# EAGLE design leddriver_1 (EAGLE 8.2.0)
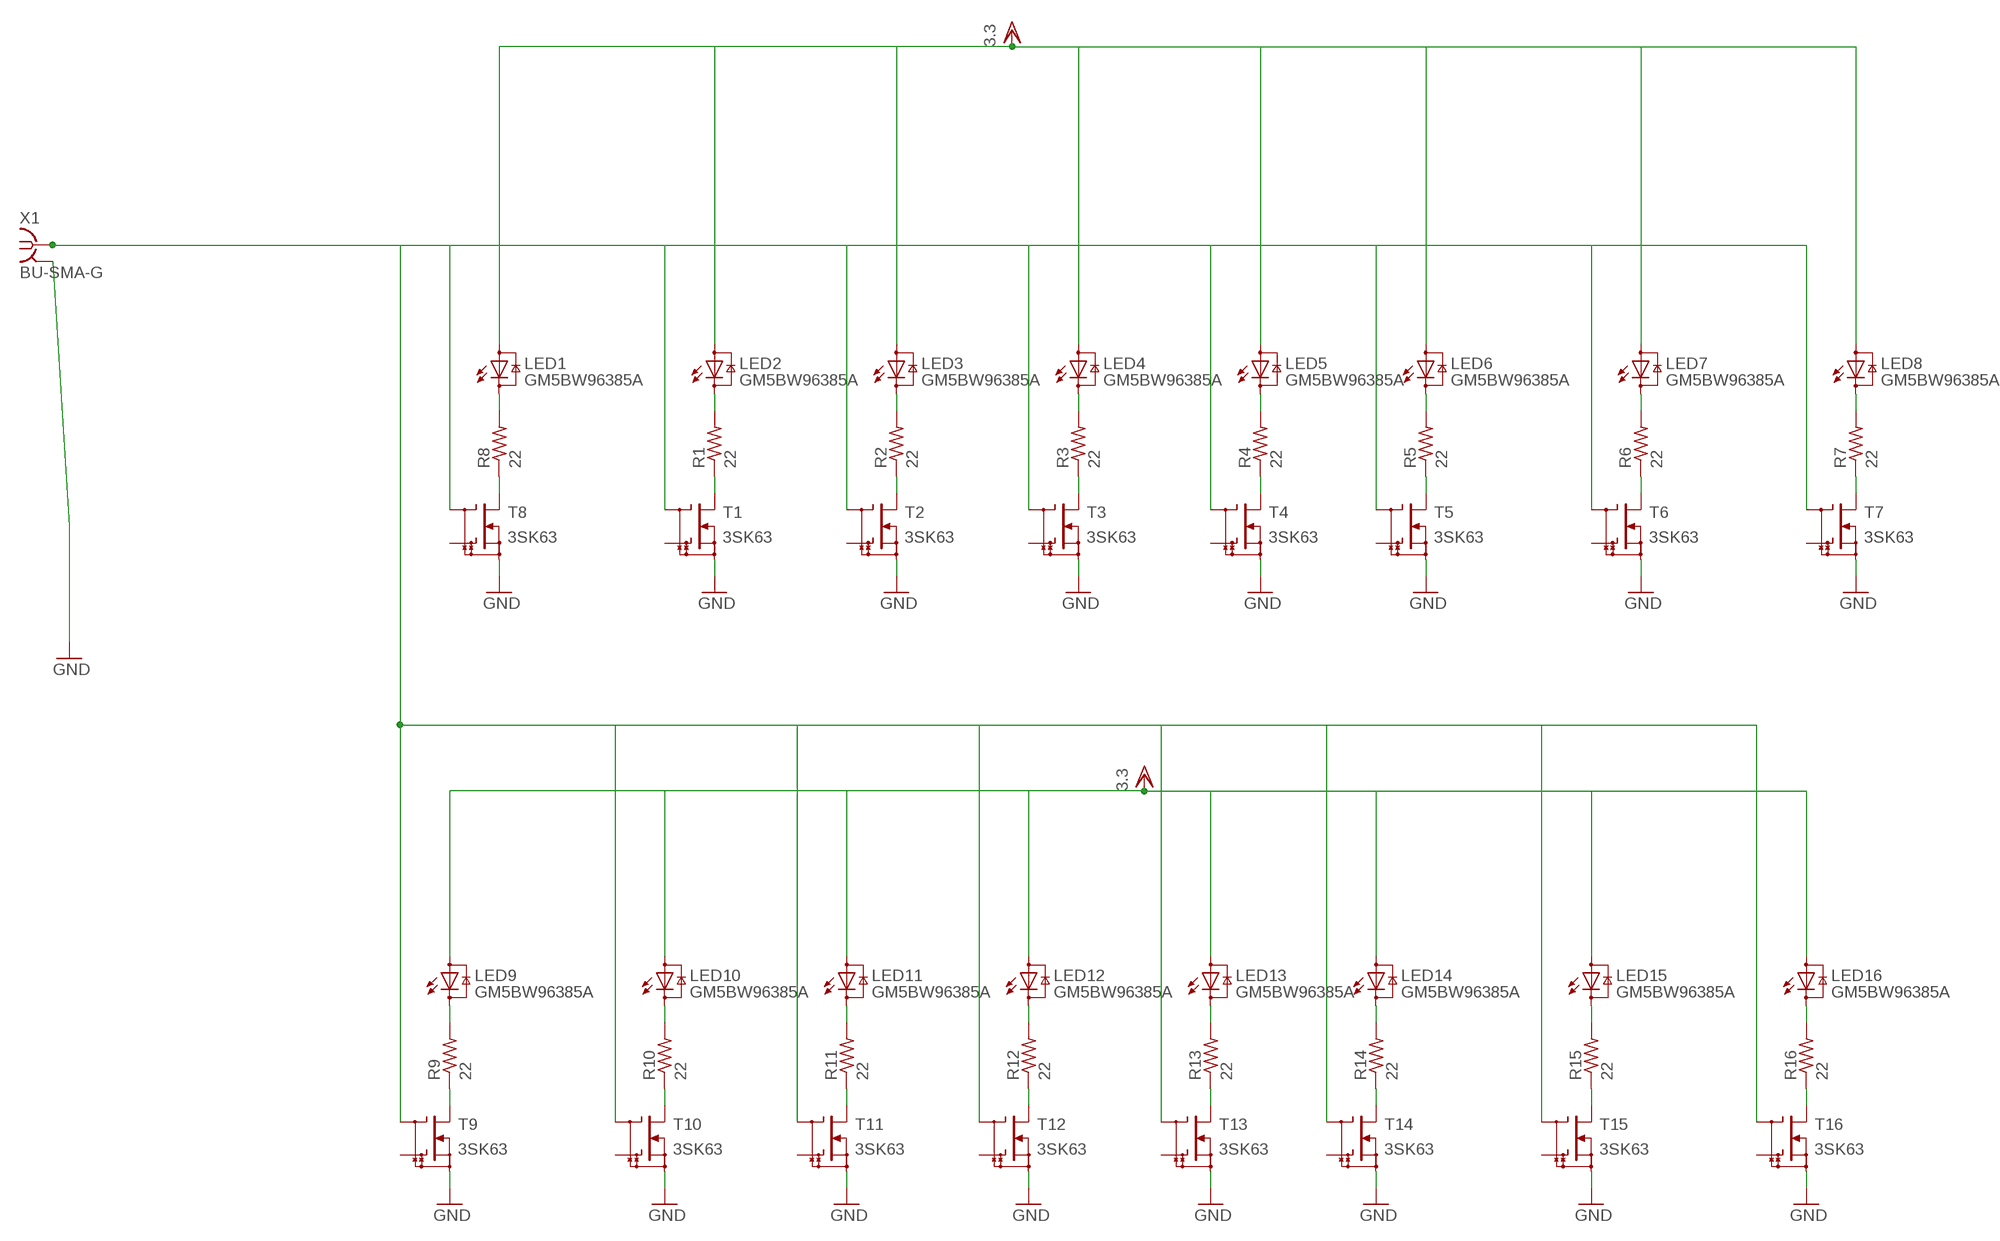
[diagram p0: schematic, sheet 1]

## Parts
LED1  GM5BW96385A  [GM5BW96385A]
LED2  GM5BW96385A  [GM5BW96385A]
LED3  GM5BW96385A  [GM5BW96385A]
LED4  GM5BW96385A  [GM5BW96385A]
LED5  GM5BW96385A  [GM5BW96385A]
LED6  GM5BW96385A  [GM5BW96385A]
LED7  GM5BW96385A  [GM5BW96385A]
LED8  GM5BW96385A  [GM5BW96385A]
LED9  GM5BW96385A  [GM5BW96385A]
LED10  GM5BW96385A  [GM5BW96385A]
LED11  GM5BW96385A  [GM5BW96385A]
LED12  GM5BW96385A  [GM5BW96385A]
LED13  GM5BW96385A  [GM5BW96385A]
LED14  GM5BW96385A  [GM5BW96385A]
LED15  GM5BW96385A  [GM5BW96385A]
LED16  GM5BW96385A  [GM5BW96385A]
R1  22  R-US_0207/5V  [0207/5V]
R2  22  R-US_0207/5V  [0207/5V]
R3  22  R-US_0207/5V  [0207/5V]
R4  22  R-US_0207/5V  [0207/5V]
R5  22  R-US_0207/5V  [0207/5V]
R6  22  R-US_0207/5V  [0207/5V]
R7  22  R-US_0207/5V  [0207/5V]
R8  22  R-US_0207/5V  [0207/5V]
R9  22  R-US_0207/5V  [0207/5V]
R10  22  R-US_0207/5V  [0207/5V]
R11  22  R-US_0207/5V  [0207/5V]
R12  22  R-US_0207/5V  [0207/5V]
R13  22  R-US_0207/5V  [0207/5V]
R14  22  R-US_0207/5V  [0207/5V]
R15  22  R-US_0207/5V  [0207/5V]
R16  22  R-US_0207/5V  [0207/5V]
T1  3SK63  [TO72]
T2  3SK63  [TO72]
T3  3SK63  [TO72]
T4  3SK63  [TO72]
T5  3SK63  [TO72]
T6  3SK63  [TO72]
T7  3SK63  [TO72]
T8  3SK63  [TO72]
T9  3SK63  [TO72]
T10  3SK63  [TO72]
T11  3SK63  [TO72]
T12  3SK63  [TO72]
T13  3SK63  [TO72]
T14  3SK63  [TO72]
T15  3SK63  [TO72]
T16  3SK63  [TO72]
X1  BU-SMA-G  [BU-SMA-G]

## Nets
GND: T1.4(SOURCE) T2.4(SOURCE) T3.4(SOURCE) T4.4(SOURCE) T5.4(SOURCE) T6.4(SOURCE) T7.4(SOURCE) T8.4(SOURCE) T9.4(SOURCE) T10.4(SOURCE) T11.4(SOURCE) T12.4(SOURCE) T13.4(SOURCE) T14.4(SOURCE) T15.4(SOURCE) T16.4(SOURCE) X1.2 X1.3 X1.4 X1.5
N$1: R8.1 T8.1(DRAIN)
N$2: LED2.C R1.2
N$3: LED1.C R8.2
N$4: R1.1 T1.1(DRAIN)
N$5: LED3.C R2.2
N$6: R2.1 T2.1(DRAIN)
N$7: LED4.C R3.2
N$8: R3.1 T3.1(DRAIN)
N$9: LED5.C R4.2
N$10: R4.1 T4.1(DRAIN)
N$11: LED6.C R5.2
N$12: R5.1 T5.1(DRAIN)
N$13: LED7.C R6.2
N$14: R6.1 T6.1(DRAIN)
N$15: LED8.C R7.2
N$16: R7.1 T7.1(DRAIN)
N$17: LED9.C R9.2
N$18: R9.1 T9.1(DRAIN)
N$19: LED10.C R10.2
N$20: R10.1 T10.1(DRAIN)
N$21: LED11.C R11.2
N$22: R11.1 T11.1(DRAIN)
N$23: LED12.C R12.2
N$24: R12.1 T12.1(DRAIN)
N$25: LED13.C R13.2
N$26: R13.1 T13.1(DRAIN)
N$27: LED14.C R14.2
N$28: R14.1 T14.1(DRAIN)
N$29: LED15.C R15.2
N$30: R15.1 T15.1(DRAIN)
N$31: LED16.C R16.2
N$32: R16.1 T16.1(DRAIN)
N$33: T1.3(G1) T2.3(G1) T3.3(G1) T4.3(G1) T5.3(G1) T6.3(G1) T7.3(G1) T8.3(G1) T9.3(G1) T10.3(G1) T11.3(G1) T12.3(G1) T13.3(G1) T14.3(G1) T15.3(G1) T16.3(G1) X1.1
VDD: LED1.A LED2.A LED3.A LED4.A LED5.A LED6.A LED7.A LED8.A LED9.A LED10.A LED11.A LED12.A LED13.A LED14.A LED15.A LED16.A ; supply symbol labelled 3.3
Unconnected: T1.2(G2) T2.2(G2) T3.2(G2) T4.2(G2) T5.2(G2) T6.2(G2) T7.2(G2) T8.2(G2) T9.2(G2) T10.2(G2) T11.2(G2) T12.2(G2) T13.2(G2) T14.2(G2) T15.2(G2) T16.2(G2)

## Library data of the parts
LED1-LED16 = led:GM5BW96385A: High brightness White Color LED 2300 mcd @ IF = 20mA achieved via InGaN Blue LED chip in combination with Yellow Phosphor Source: http://document.sharpsma.com/files/GM5BW96385A.pdf
R1-R16 = resistor:R-US_: RESISTOR, American symbol
T1-T16 = transistor:3SK63: N CHANNEL Dual Gate MOS FET VHF Amplifier Source: 3SK59.pdf
X1 = con-coax:BU-SMA-G: FEMALE SMA CONNECTOR Radiall distributor RS 193-9117; OC_FARNELL: unknown; OC_NEWARK: unknown

## Board
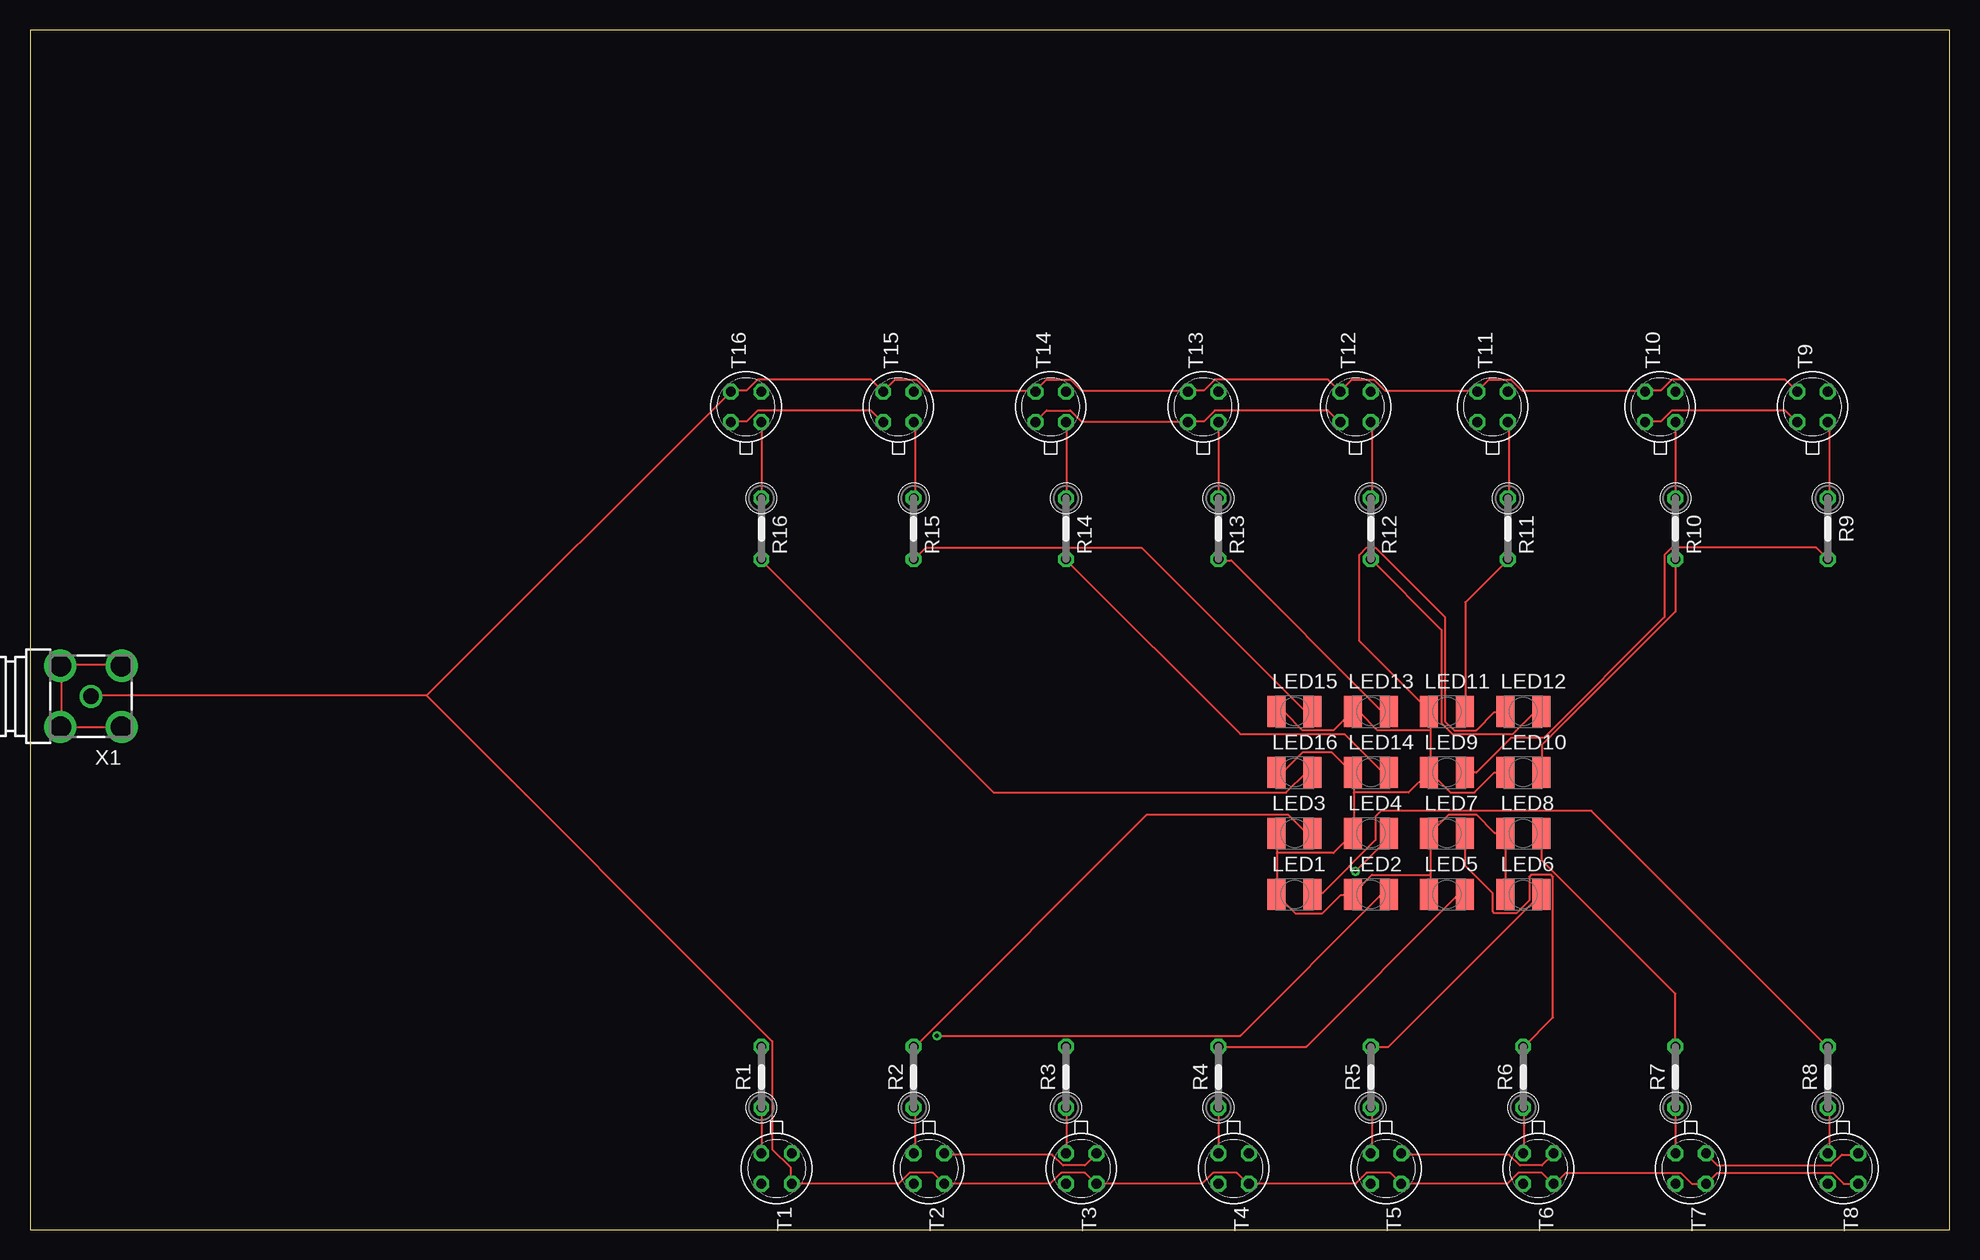
[diagram p1: board, top side]
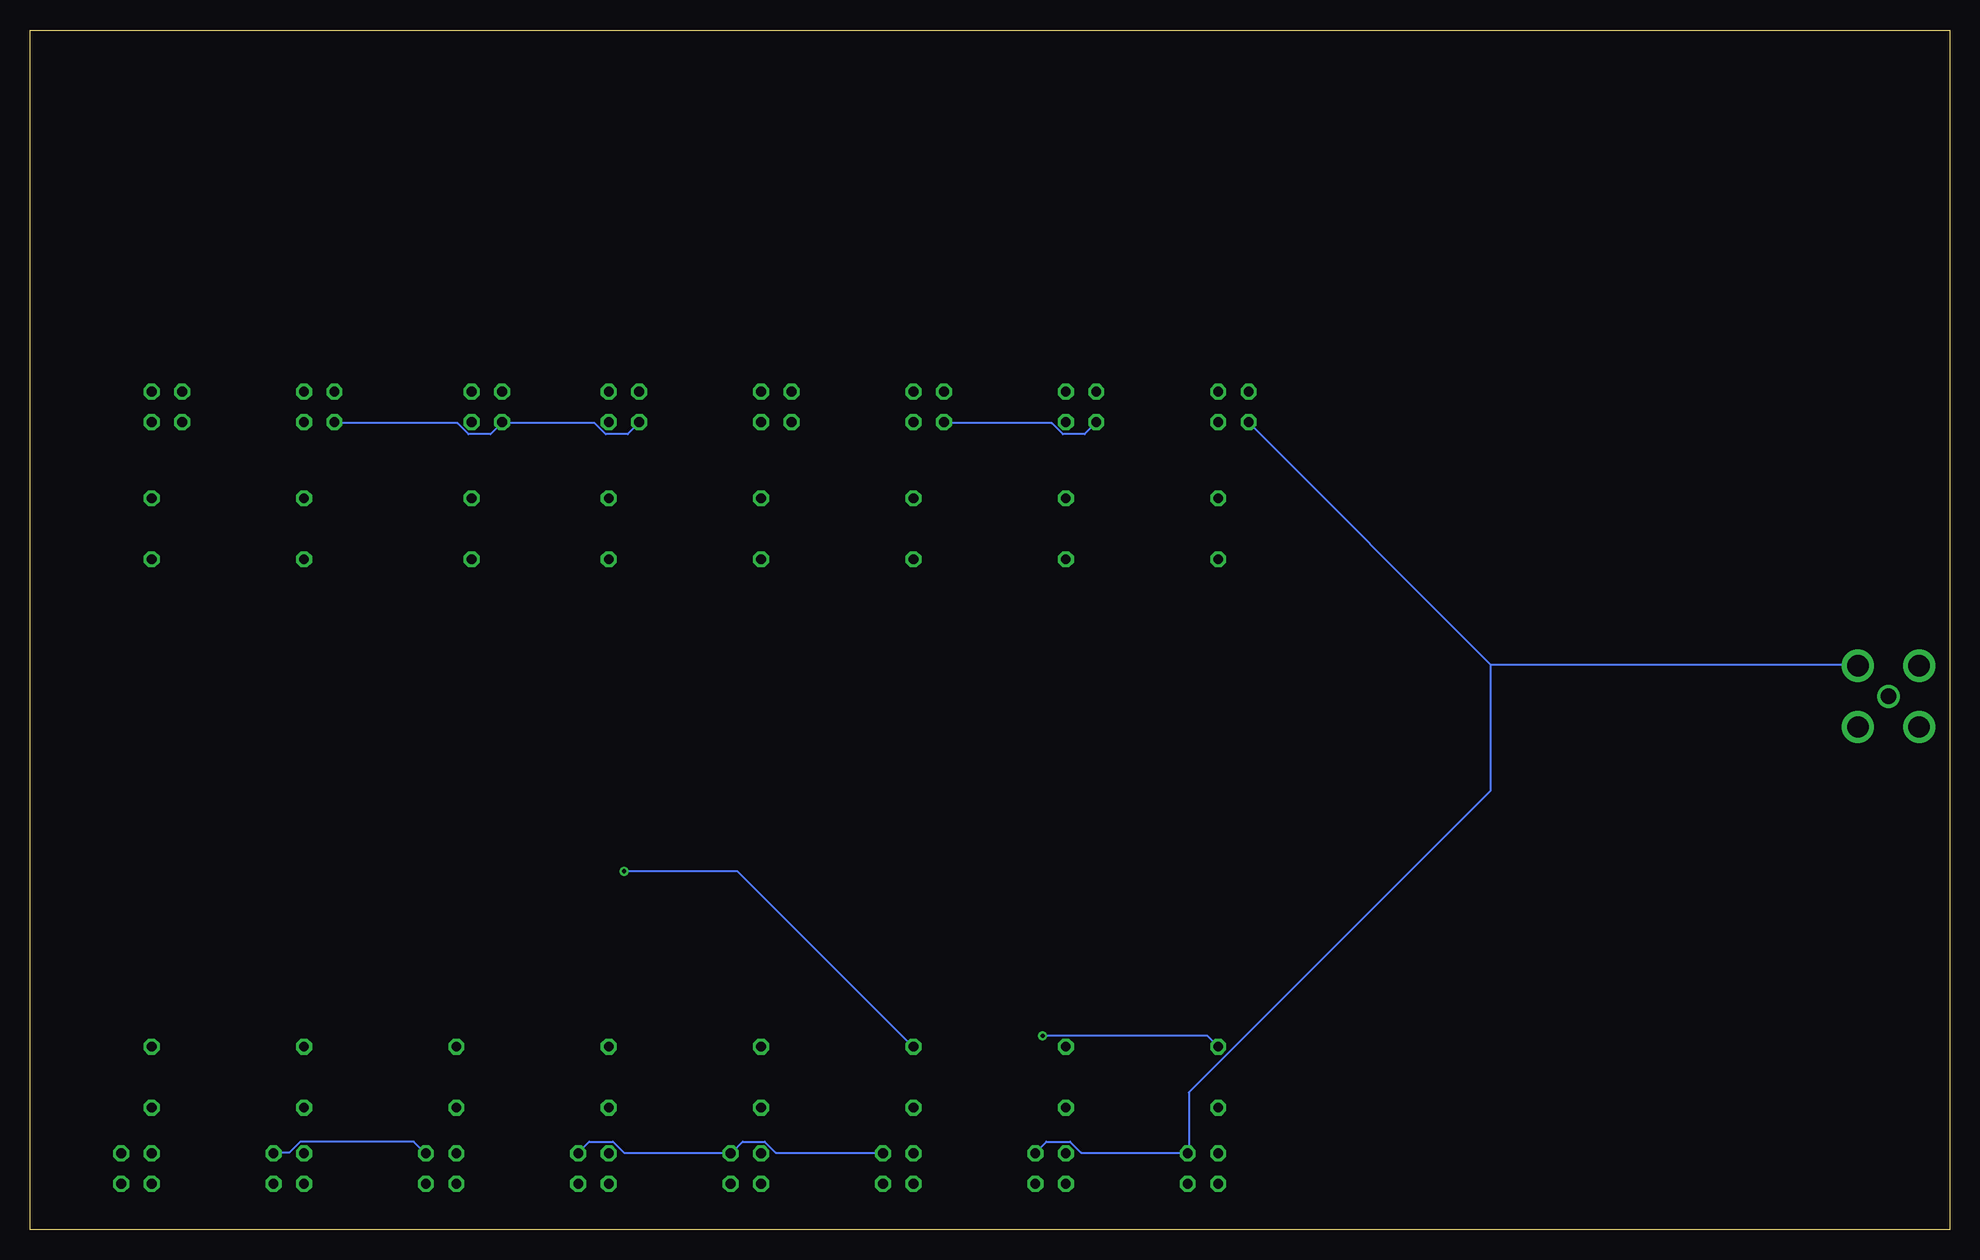
[diagram p2: board, bottom side, seen from below]

Size 160 x 100 mm. Coordinates in mm from the lower left corner, seen from the top.
Outline: 0,0 160,0 160,100 0,100 0,0
Copper layers (1*16): Top 0.035mm / dielectric 1.5mm / Bottom 0.035mm
Design rules "default": minimum track width 6mil, minimum drill 0.35mm, track to track 6mil, track to pad 6mil, pad to pad 6mil, via to via 6mil, smd to smd 6mil, copper to edge 40mil, drill to drill 6mil, minimum pad ring 10mil, minimum via ring 8mil, stop-mask expansion 4mil, vias tented up to drill 0mil, thermal gap 10mil

### Footprints (pad centres in the part's own frame; a part is rotated, then mirrored left to right if it is on the bottom)
GM5BW96385A = smd 1.5 x 2.6: A -1.5,0; C 1.5,0
0207/5V = drill 0.813 octagon: 1 -2.54,0; 2 2.54,0
TO72 = drill 0.813 octagon: 1 -1.27,-1.27; 2 1.27,-1.27; 3 1.27,1.27; 4 -1.27,1.27
BU-SMA-G = drill 1.27: 1 0,0 | drill 1.778: 2 -2.55,2.55; 3 2.55,2.55; 4 2.55,-2.55; 5 -2.55,-2.55

### Placement (x,y rotation side)
LED1  105.41,27.94 0 top
LED2  111.76,27.94 0 top
LED3  105.41,33.02 0 top
LED4  111.76,33.02 0 top
LED5  118.11,27.94 0 top
LED6  124.46,27.94 0 top
LED7  118.11,33.02 0 top
LED8  124.46,33.02 0 top
LED9  118.11,38.1 0 top
LED10  124.46,38.1 0 top
LED11  118.11,43.18 0 top
LED12  124.46,43.18 0 top
LED13  111.76,43.18 0 top
LED14  111.76,38.1 0 top
LED15  105.41,43.18 0 top
LED16  105.41,38.1 0 top
R1  60.96,12.7 90 top
R2  73.66,12.7 90 top
R3  86.36,12.7 90 top
R4  99.06,12.7 90 top
R5  111.76,12.7 90 top
R6  124.46,12.7 90 top
R7  137.16,12.7 90 top
R8  149.86,12.7 90 top
R9  149.86,58.42 270 top
R10  137.16,58.42 270 top
R11  123.19,58.42 270 top
R12  111.76,58.42 270 top
R13  99.06,58.42 270 top
R14  86.36,58.42 270 top
R15  73.66,58.42 270 top
R16  60.96,58.42 270 top
T1  62.23,5.08 270 top
T2  74.93,5.08 270 top
T3  87.63,5.08 270 top
T4  100.33,5.08 270 top
T5  113.03,5.08 270 top
T6  125.73,5.08 270 top
T7  138.43,5.08 270 top
T8  151.13,5.08 270 top
T9  148.59,68.58 90 top
T10  135.89,68.58 90 top
T11  121.92,68.58 90 top
T12  110.49,68.58 90 top
T13  97.79,68.58 90 top
T14  85.09,68.58 90 top
T15  72.39,68.58 90 top
T16  59.69,68.58 90 top
X1  5.08,44.45 180 top

### Tracks (layer width: path | path; a pad name or v marks a point on that pad's centre or on a via)
GND
  Top 0.152: T2.4 76.2,6.25 85.19,6.25 86.11,5.33 87.94,5.33 88.85,6.25 T3.4 | T5.4 114.3,6.25 123.29,6.25 124.21,5.33 126.03,5.33 126.95,6.25 T6.4 | T8.4 152.4,6.25 151.03,6.25 150.11,5.33 140.66,5.33 139.75,6.25 T7.4 | T10.4 134.72,67.36 135.94,67.36 136.85,68.28 146.3,68.28 147.22,67.36 T9.4 | T12.4 109.12,67.36 108.2,68.28 98.75,68.28 97.84,67.36 96.62,67.36 T13.4 96.47,67.36 87.63,67.36 86.72,68.28 84.73,68.28 83.82,67.36 T14.4 | 2.59,41.91 2.59,46.94 X1.4 2.59,47.09 7.62,47.09 X1.5 | 2.59,41.91 X1.2 | 2.59,41.91 X1.3 | T16.4 58.52,67.36 59.74,67.36 60.66,68.28 70.1,68.28 71.02,67.36 T15.4
  Bottom 0.152: T2.4 76.2,6.4 75.29,7.32 73.3,7.32 72.39,6.4 63.55,6.4 T1.4 63.4,6.4 63.4,11.43 38.25,36.58 38.25,47.09 | T3.4 89,6.4 97.84,6.4 98.75,7.32 100.58,7.32 101.5,6.4 T4.4 101.65,6.4 110.49,6.4 111.4,7.32 113.39,7.32 114.3,6.4 T5.4 | T7.4 139.6,6.4 138.38,6.4 137.47,7.32 128.02,7.32 127.1,6.4 T6.4 | T12.4 109.27,67.21 110.19,66.29 112.01,66.29 112.93,67.21 120.55,67.21 T11.4 120.7,67.21 121.61,66.29 123.44,66.29 124.36,67.21 134.57,67.21 T10.4 | T14.4 83.82,67.21 74.83,67.21 73.91,66.29 72.08,66.29 71.17,67.21 T15.4 | 38.25,47.09 7.77,47.09 X1.5 | 38.25,47.09 58.37,67.21 T16.4
N$1
  Top 0.152: T8.1 149.96,6.4 149.96,10.06 R8.1
N$2  (via drill 0.35)
  Top 0.152: v75.59,16.15 100.89,16.15 112.62,27.89 113.23,27.89 LED2.C
  Bottom 0.152: v75.59,16.15 61.87,16.15 R1.2
N$3
  Top 0.152: LED1.C 106.98,28.04 107.75,28.04 112.17,32.46 112.17,34.44 112.62,34.9 130.15,34.9 149.81,15.24 R8.2
N$4
  Top 0.152: R1.1 T1.1
N$5
  Top 0.152: LED3.C 106.83,33.07 106.38,33.07 104.85,34.59 93.12,34.59 73.76,15.24 R2.2
N$6
  Top 0.152: T2.1 73.76,6.4 73.76,10.06 R2.1
N$7  (via drill 0.35)
  Top 0.152: v110.49,29.87 113.23,32.61 113.23,32.92 LED4.C
  Bottom 0.152: v110.49,29.87 101.04,29.87 86.41,15.24 R3.2
N$8
  Top 0.152: T3.1 86.41,6.4 86.41,10.06 R3.1
N$9
  Top 0.152: R4.2 106.38,15.24 119.02,27.89 119.48,27.89 LED5.C
N$10
  Top 0.152: R4.1 T4.1
N$11
  Top 0.152: R5.2 113.23,15.24 125.88,27.89 LED6.C
N$12
  Top 0.152: T5.1 111.86,6.4 111.86,10.06 R5.1
N$13
  Top 0.152: LED7.C 119.63,32.92 119.63,30.33 121.92,28.04 121.92,26.52 122.07,26.36 123.9,26.36 124.97,27.43 124.97,29.41 125.12,29.57 126.8,29.57 126.95,29.41 126.95,17.68 124.51,15.24 R6.2
N$14
  Top 0.152: T6.1 124.51,6.4 124.51,10.06 R6.1
N$15
  Top 0.152: R7.2 137.16,19.66 126.03,30.79 126.03,32.92 LED8.C
N$16
  Top 0.152: R7.1 T7.1
N$17
  Top 0.152: LED9.C 120.55,38.1 123.44,41 126.19,41 136.25,51.05 136.25,56.24 136.85,56.84 148.9,56.84 R9.2
N$18
  Top 0.152: R9.1 149.96,60.96 149.96,67.21 T9.1
N$19
  Top 0.152: R10.2 137.16,51.51 126.03,40.39 126.03,38.1 LED10.C
N$20
  Top 0.152: T10.1 R10.1
N$21
  Top 0.152: LED11.C 119.63,43.28 119.63,52.27 123.14,55.78 R11.2
N$22
  Top 0.152: R11.1 123.29,60.96 123.29,67.21 T11.1
N$23
  Top 0.152: R12.2 117.65,49.99 117.65,42.22 118.57,41.3 123.6,41.3 125.42,43.13 125.88,43.13 LED12.C
N$24
  Top 0.152: R12.1 111.86,60.96 111.86,67.21 T12.1
N$25
  Top 0.152: LED13.C 113.23,43.28 112.62,43.28 100.13,55.78 99.06,55.78 R13.2
N$26
  Top 0.152: T13.1 R13.1
N$27
  Top 0.152: LED14.C 112.78,38.1 109.58,41.3 100.89,41.3 86.41,55.78 R14.2
N$28
  Top 0.152: R14.1 86.41,60.96 86.41,67.21 T14.1
N$29
  Top 0.152: LED15.C 106.83,43.28 106.22,43.28 92.66,56.84 74.68,56.84 73.76,55.93 R15.2
N$30
  Top 0.152: R15.1 73.76,60.96 73.76,67.21 T15.1
N$31
  Top 0.152: LED16.C 106.38,38.1 104.7,36.42 80.31,36.42 60.96,55.78 R16.2
N$32
  Top 0.152: T16.1 R16.1
N$33
  Top 0.152: T8.3 151.18,3.81 150.27,4.72 140.66,4.72 139.75,3.81 T7.3 138.53,3.81 137.62,4.72 128.02,4.72 127.1,3.81 T6.3 126.95,3.81 126.03,4.72 124.05,4.72 123.14,3.81 T5.3 113.39,4.72 111.4,4.72 110.49,3.81 T4.3 101.5,3.81 100.58,4.72 98.6,4.72 97.69,3.81 T3.3 88.85,3.81 87.94,4.72 85.95,4.72 85.04,3.81 T2.3 75.29,4.72 73.3,4.72 72.39,3.81 T1.3 63.4,3.81 63.4,5.18 61.87,6.71 61.87,15.7 33.07,44.5 | T9.3 146.3,70.87 136.85,70.87 135.94,69.95 134.72,69.95 T10.3 134.57,69.95 124.36,69.95 123.44,70.87 121.61,70.87 120.7,69.95 T11.3 120.55,69.95 112.93,69.95 112.01,70.87 110.19,70.87 109.27,69.95 T12.3 108.2,70.87 98.75,70.87 97.84,69.95 96.62,69.95 T13.3 96.47,69.95 87.63,69.95 86.72,70.87 84.73,70.87 83.82,69.95 | 83.82,69.95 74.83,69.95 73.91,70.87 72.08,70.87 71.17,69.95 T15.3 70.1,70.87 60.66,70.87 59.74,69.95 58.52,69.95 T16.3 33.07,44.5 | 33.07,44.5 5.18,44.5 X1.1 | 83.82,69.95 T14.3
VDD
  Top 0.152: LED6.A 122.99,28.04 122.99,32.92 LED8.A 122.83,33.07 122.07,33.07 120.55,34.59 118.26,34.59 116.74,33.07 LED7.A 116.74,32.92 116.74,29.57 | 116.74,29.57 116.74,28.04 LED5.A | 103.94,31.39 103.94,32.92 LED3.A | 103.94,31.39 103.94,28.04 LED1.A 103.94,27.89 105.46,26.36 107.75,26.36 109.27,27.89 110.19,27.89 LED2.A 110.34,28.04 111.86,29.57 116.74,29.57 | 110.34,36.42 110.34,38.1 LED14.A 110.19,38.1 108.51,39.78 106.07,39.78 104.39,38.1 LED16.A | 110.34,36.42 110.34,33.07 LED4.A 110.19,32.92 108.66,31.39 103.94,31.39 | LED15.A 103.94,43.13 104.55,43.13 106.07,41.6 108.66,41.6 110.19,43.13 LED13.A 110.34,43.13 110.8,43.13 112.32,41.6 116.74,41.6 | 116.74,41.6 116.74,43.13 LED11.A 116.59,43.28 110.8,49.07 110.8,56.24 111.4,56.84 112.17,56.84 117.96,51.05 117.96,42.37 118.72,41.6 120.55,41.6 122.07,43.13 122.83,43.13 LED12.A | 116.74,41.6 116.74,38.1 | LED10.A 122.07,38.1 120.4,36.42 118.42,36.42 116.74,38.1 | 116.74,38.1 LED9.A 116.59,38.1 114.91,36.42 110.34,36.42